# Altium project 模拟均衡器.PrjPCB
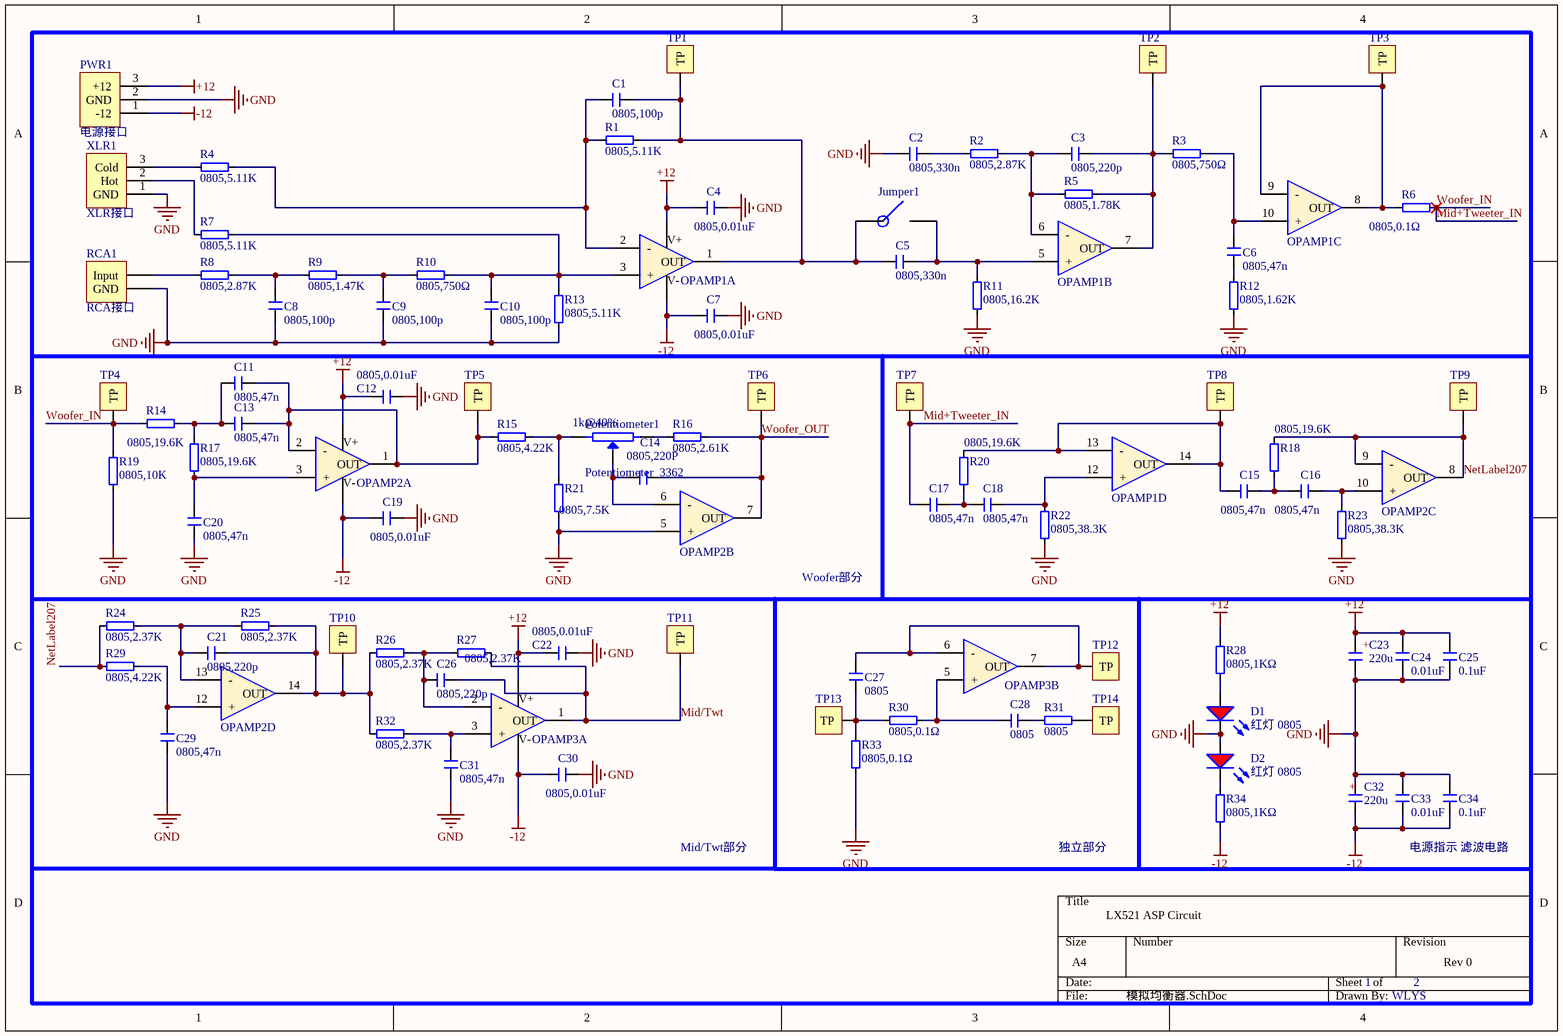
[diagram p0: 模拟均衡器.SchDoc]
2 sheets, 207 parts. Net scope: global (net labels, ports and power ports of the same name join across sheets).
Board file: 模拟均衡器.PcbDoc
Sheets:
  模拟均衡器.SchDoc
  模拟均衡器2.SchDoc

## Sheet 模拟均衡器.SchDoc: LX521 ASP Circuit
size A4; Revision: Rev 0

### Parts
C1  0805,100p  [0805_C]
C2  0805,330n  [0805_C]
C3  0805,220p  [0805_C]
C4  0805,0.01uF  [0805_C]
C5  0805,330n  [0805_C]
C6  0805,47n  [0805_C]
C7  0805,0.01uF  [0805_C]
C8  0805,100p  [0805_C]
C9  0805,100p  [0805_C]
C10  0805,100p  [0805_C]
C11  0805,47n  [0805_C]
C12  0805,0.01uF  [0805_C]
C13  0805,47n  [0805_C]
C14  0805,220P  [0805_C]
C15  0805,47n  [0805_C]
C16  0805,47n  [0805_C]
C17  0805,47n  [0805_C]
C18  0805,47n  [0805_C]
C19  0805,0.01uF  [0805_C]
C20  0805,47n  [0805_C]
C21  0805,220p  [0805_C]
C22  0805,0.01uF  [0805_C]
C23  220u
C24  0.01uF  [0805_C]
C25  0.1uF  [0805_C]
C26  0805,220p  [0805_C]
C27  0805  [0805_C]
C28  0805  [0805_C]
C29  0805,47n  [0805_C]
C30  0805,0.01uF  [0805_C]
C31  0805,47n  [0805_C]
C32  220u
C33  0.01uF  [0805_C]
C34  0.1uF  [0805_C]
D1  红灯 0805  [0805_LED_S3]
D2  红灯 0805  [0805_LED_S3]
Jumper1  Jumper  [0805_J]  (value not drawn)
OPAMP1  4277UA  (value not drawn)  (parts A,B,C,D of 4)
OPAMP2  4277UA  [SOIC-14_150mil]  (value not drawn)  (parts A,B,C,D of 4)
OPAMP3  4277UA  [SOIC-14_150mil]  (value not drawn)  (parts A,B of 4)
Potentiometer1  Potentiometer_3362  [3362P]
PWR1  电源接口
R1  0805,5.11K  [0805_R]
R2  0805,2.87K  [0805_R]
R3  0805,750Ω  [0805_R]
R4  0805,5.11K  [0805_R]
R5  0805,1.78K  [0805_R]
R6  0805,0.1Ω  [0805_R]
R7  0805,5.11K  [0805_R]
R8  0805,2.87K  [0805_R]
R9  0805,1.47K  [0805_R]
R10  0805,750Ω  [0805_R]
R11  0805,16.2K  [0805_R]
R12  0805,1.62K  [0805_R]
R13  0805,5.11K  [0805_R]
R14  0805,19.6K  [0805_R]
R15  0805,4.22K  [0805_R]
R16  0805,2.61K  [0805_R]
R17  0805,19.6K  [0805_R]
R18  0805,19.6K  [0805_R]
R19  0805,10K  [0805_R]
R20  0805,19.6K  [0805_R]
R21  0805,7.5K  [0805_R]
R22  0805,38.3K  [0805_R]
R23  0805,38.3K  [0805_R]
R24  0805,2.37K  [0805_R]
R25  0805,2.37K  [0805_R]
R26  0805,2.37K  [0805_R]
R27  0805,2.37K  [0805_R]
R28  0805,1KΩ  [0805_R]
R29  0805,4.22K  [0805_R]
R30  0805,0.1Ω  [0805_R]
R31  0805  [0805_R]
R32  0805,2.37K  [0805_R]
R33  0805,0.1Ω  [0805_R]
R34  0805,1KΩ  [0805_R]
RCA1  RCA接口  [XH2.54-LI-2P]
TP1  测试点  [TestPoint]  (value not drawn)
TP2  测试点  [TestPoint]  (value not drawn)
TP3  测试点  [TestPoint]  (value not drawn)
TP4  测试点  [TestPoint]  (value not drawn)
TP5  测试点  [TestPoint]  (value not drawn)
TP6  测试点  [TestPoint]  (value not drawn)
TP7  测试点  [TestPoint]  (value not drawn)
TP8  测试点  [TestPoint]  (value not drawn)
TP9  测试点  [TestPoint]  (value not drawn)
TP10  测试点  [TestPoint]  (value not drawn)
TP11  测试点  [TestPoint]  (value not drawn)
TP12  测试点  [TestPoint]  (value not drawn)
TP13  测试点  [TestPoint]  (value not drawn)
TP14  测试点  [TestPoint]  (value not drawn)
XLR1  XLR接口

### Nets
+12: C4.1 C12.1 C22.1 C23.1 C24.2 C25.2 OPAMP1.4(V+) OPAMP2.4(V+) OPAMP3.4(V+) PWR1.3(+12) R28.1
-12: C7.1 C19.1 C30.1 C32.2 C33.1 C34.1 OPAMP1.11(V-) OPAMP2.11(V-) OPAMP3.11(V-) PWR1.1(-12) R34.2
GND: C2.1 C4.2 C7.2 C8.2 C9.2 C10.2 C12.2 C19.2 C20.1 C22.2 C23.2 C24.1 C25.1 C29.1 C30.2 C31.1 C32.1 C33.2 C34.2 D1.K D2.A OPAMP2.5(+) PWR1.2(GND) R11.1 R12.1 R13.1 R19.1 R21.2 R22.1 R23.1 R33.2 RCA1.2(GND) XLR1.1(GND)
Mid+Tweeter_IN: C17.1 R6.2 R14.1 R19.2 TP4.1(TP) TP7.1(TP)  [also labelled Woofer_IN]
Mid/Twt: C26.1 OPAMP3.1(OUT) R27.1 TP11.1(TP)
NetLabel207: OPAMP2.8(OUT) OPAMP2.9(-) R18.2 R24.2 R29.2 TP9.1(TP)
Woofer_OUT: C14.1 OPAMP2.7(OUT) R16.1 TP6.1(TP)
NetC1_1: C1.1 OPAMP1.2(-) R1.1 R4.2
NetC1_2: C1.2 C5.1 Jumper1.1 OPAMP1.1(OUT) R1.2 TP1.1(TP)
NetC2_2: C2.2 R2.1
NetC3_1: C3.1 OPAMP1.6(-) R2.2 R5.1
NetC3_2: C3.2 OPAMP1.7(OUT) R3.1 R5.2 TP2.1(TP)
NetC5_2: C5.2 Jumper1.2 OPAMP1.5(+) R11.2
NetC6_1: C6.1 R12.2
NetC6_2: C6.2 OPAMP1.10(+) R3.2
NetC8_1: C8.1 R8.2 R9.1
NetC9_1: C9.1 R9.2 R10.1
NetC10_1: C10.1 OPAMP1.3(+) R7.2 R10.2 R13.2
NetC11_1: C11.1 C13.1 OPAMP2.1(OUT) OPAMP2.2(-) R15.2 TP5.1(TP)
NetC11_2: C11.2 C13.2 R14.2 R17.2
NetC14_2: C14.2 OPAMP2.6(-) Potentiometer1.2(W)
NetC15_1: C15.1 C16.2 R18.1
NetC15_2: C15.2 OPAMP1.13(-) OPAMP1.14(OUT) R20.2 TP8.1(TP)
NetC16_1: C16.1 OPAMP2.10(+) R23.2
NetC17_2: C17.2 C18.1 R20.1
NetC18_2: C18.2 OPAMP1.12(+) R22.2
NetC20_2: C20.2 OPAMP2.3(+) R17.1
NetC21_1: C21.1 OPAMP2.14(OUT) R25.1 R26.2 R32.2 TP10.1(TP)
NetC21_2: C21.2 OPAMP2.13(-) R24.1 R25.2
NetC26_2: C26.2 OPAMP3.2(-) R26.1 R27.2
NetC27_1: C27.1 R30.2 R33.1 TP13.1(TP)
NetC27_2: C27.2 OPAMP3.6(-) OPAMP3.7(OUT) TP12.1(TP)
NetC28_1: C28.1 R31.2
NetC28_2: C28.2 OPAMP3.5(+) R30.1
NetC29_2: C29.2 OPAMP2.12(+) R29.1
NetC31_2: C31.2 OPAMP3.3(+) R32.1
NetD1_A: D1.A R28.2
NetD2_K: D2.K R34.1
NetOPAMP1_8: OPAMP1.8(OUT) OPAMP1.9(-) R6.1 TP3.1(TP)
NetPotentiometer1_1: Potentiometer1.1 R16.2
NetPotentiometer1_3: Potentiometer1.3 R15.1 R21.1
NetR4_1: R4.1 XLR1.3(Cold)
NetR7_1: R7.1 XLR1.2(Hot)
NetR8_1: R8.1 RCA1.1(Input)
NetR31_1: R31.1 TP14.1(TP)

### Notes on the sheet
- (near Potentiometer1) 1k@40%
- Woofer部分
- Mid/Twt部分
- 独立部分
- 电源指示 滤波电路
- LX521 ASP Circuit
- 1
- 2
- Rev 0
- WLYS
- (in symbol C直插电解) +

### Library data of the parts
C1-C3 C5 C6 C8-C11 C13-C18 C20 C21 C24-C26 C29 C31 C33 C34 = C0805
C4 C7 C12 C19 C22 C27 C28 C30 = C0805: 0.01uF
C23 C32 = C直插电解
D1 D2 = 0805 红灯: 发光二极管; ComponentLink1Description: 供应商链接; ComponentLink1URL: http://www.szlcsc.com/product/details_2668.html; Package: 0805; Supplier: LC; SuppliersPartNumber: C2295
OPAMP1-OPAMP3 = OPA4277UA
R1-R34 = R0805

## Sheet 模拟均衡器2.SchDoc
size A4
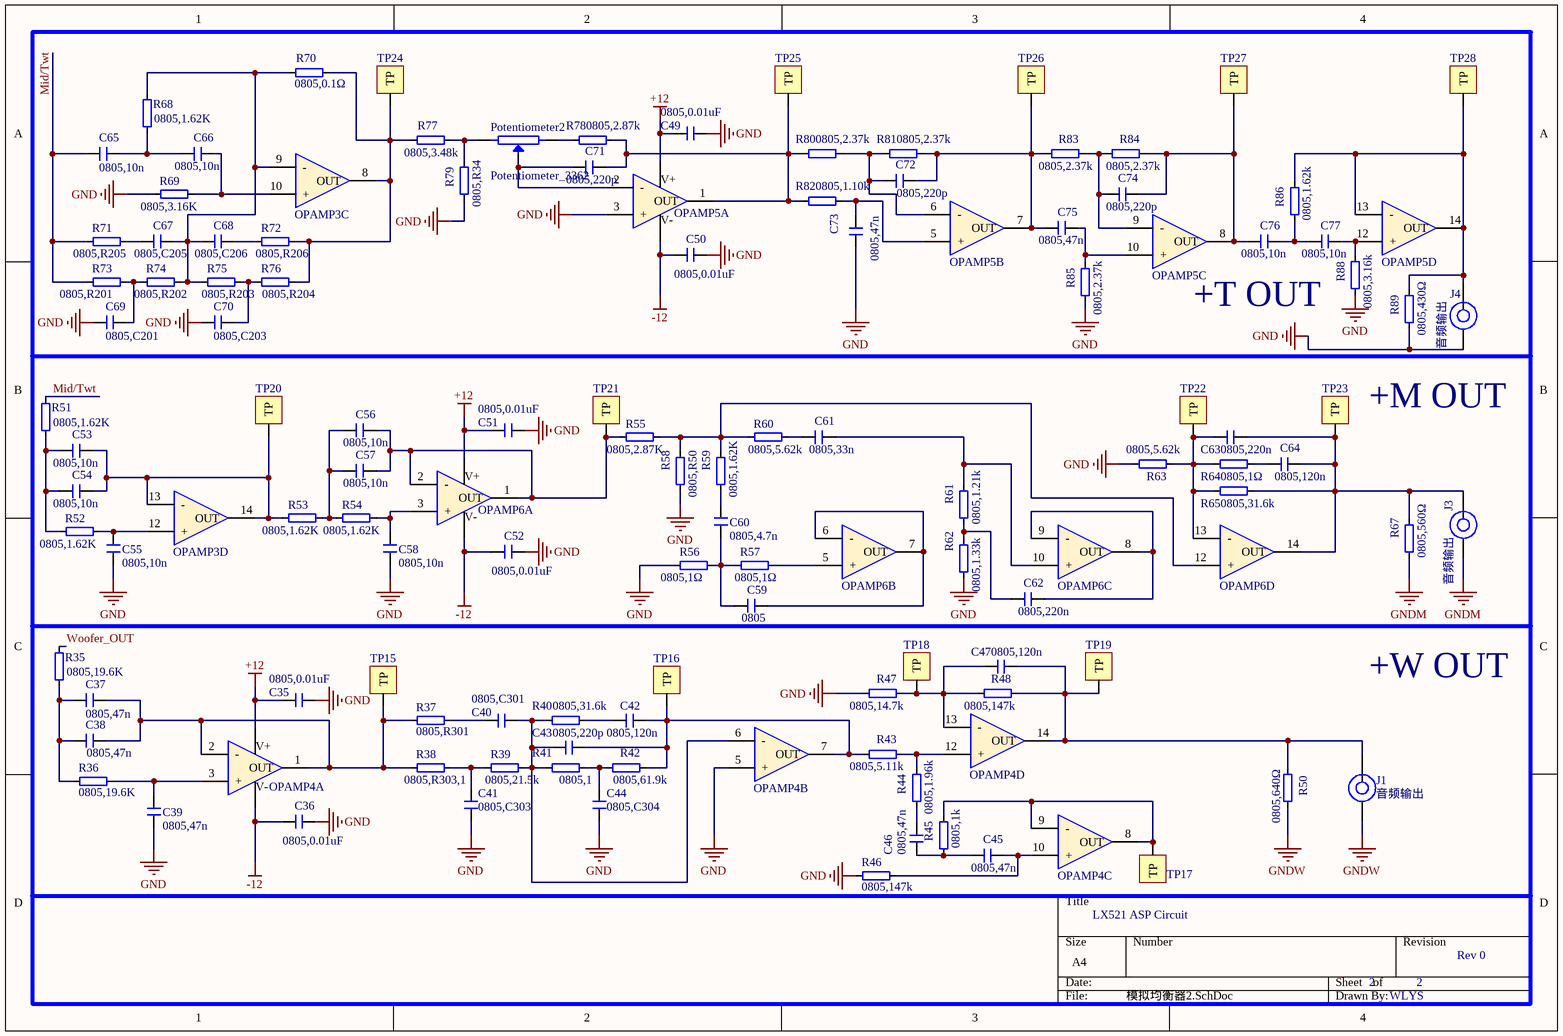
[diagram p1: 模拟均衡器2.SchDoc]

### Parts
C35  0805,0.01uF  [0805_C]
C36  0805,0.01uF  [0805_C]
C37  0805,47n  [0805_C]
C38  0805,47n  [0805_C]
C39  0805,47n  [0805_C]
C40  0805,C301  [0805_C]
C41  0805,C303  [0805_C]
C42  0805,120n  [0805_C]
C43  0805,220p  [0805_C]
C44  0805,C304  [0805_C]
C45  0805,47n  [0805_C]
C46  0805,47n  [0805_C]
C47  0805,120n  [0805_C]
C49  0805,0.01uF  [0805_C]
C50  0805,0.01uF  [0805_C]
C51  0805,0.01uF  [0805_C]
C52  0805,0.01uF  [0805_C]
C53  0805,10n  [0805_C]
C54  0805,10n  [0805_C]
C55  0805,10n  [0805_C]
C56  0805,10n  [0805_C]
C57  0805,10n  [0805_C]
C58  0805,10n  [0805_C]
C59  0805  [0805_C]
C60  0805,4.7n  [0805_C]
C61  0805,33n  [0805_C]
C62  0805,220n  [0805_C]
C63  0805,220n  [0805_C]
C64  0805,120n  [0805_C]
C65  0805,10n  [0805_C]
C66  0805,10n  [0805_C]
C67  0805,C205  [0805_C]
C68  0805,C206  [0805_C]
C69  0805,C201  [0805_C]
C70  0805,C203  [0805_C]
C71  0805,220p  [0805_C]
C72  0805,220p  [0805_C]
C73  0805,47n  [0805_C]
C74  0805,220p  [0805_C]
C75  0805,47n  [0805_C]
C76  0805,10n  [0805_C]
C77  0805,10n  [0805_C]
J1  音频输出
J3  音频输出
J4  音频输出
OPAMP3  4277UA  [SOIC-14_150mil]  (value not drawn)  (parts C,D of 4)
OPAMP4  4277UA  [SOIC-14_150mil]  (value not drawn)  (parts A,B,C,D of 4)
OPAMP5  4277UA  [SOIC-14_150mil]  (value not drawn)  (parts A,B,C,D of 4)
OPAMP6  4277UA  [SOIC-14_150mil]  (value not drawn)  (parts A,B,C,D of 4)
Potentiometer2  Potentiometer_3362  [3362P]
R35  0805,19.6K  [0805_R]
R36  0805,19.6K  [0805_R]
R37  0805,R301  [0805_R]
R38  0805,R303,1  [0805_R]
R39  0805,21.5k  [0805_R]
R40  0805,31.6k  [0805_R]
R41  0805,1  [0805_R]
R42  0805,61.9k  [0805_R]
R43  0805,5.11k  [0805_R]
R44  0805,1.96k  [0805_R]
R45  0805,1k  [0805_R]
R46  0805,147k  [0805_R]
R47  0805,14.7k  [0805_R]
R48  0805,147k  [0805_R]
R50  0805,640Ω  [0805_R]
R51  0805,1.62K  [0805_R]
R52  0805,1.62K  [0805_R]
R53  0805,1.62K  [0805_R]
R54  0805,1.62K  [0805_R]
R55  0805,2.87K  [0805_R]
R56  0805,1Ω  [0805_R]
R57  0805,1Ω  [0805_R]
R58  0805,R50  [0805_R]
R59  0805,1.62K  [0805_R]
R60  0805,5.62k  [0805_R]
R61  0805,1.21k  [0805_R]
R62  0805,1.33k  [0805_R]
R63  0805,5.62k  [0805_R]
R64  0805,1Ω  [0805_R]
R65  0805,31.6k  [0805_R]
R67  0805,560Ω  [0805_R]
R68  0805,1.62K  [0805_R]
R69  0805,3.16K  [0805_R]
R70  0805,0.1Ω  [0805_R]
R71  0805,R205  [0805_R]
R72  0805,R206  [0805_R]
R73  0805,R201  [0805_R]
R74  0805,R202  [0805_R]
R75  0805,R203  [0805_R]
R76  0805,R204  [0805_R]
R77  0805,3.48k  [0805_R]
R78  0805,2.87k  [0805_R]
R79  0805,R34  [0805_R]
R80  0805,2.37k  [0805_R]
R81  0805,2.37k  [0805_R]
R82  0805,1.10k  [0805_R]
R83  0805,2.37k  [0805_R]
R84  0805,2.37k  [0805_R]
R85  0805,2.37k  [0805_R]
R86  0805,1.62k  [0805_R]
R88  0805,3.16k  [0805_R]
R89  0805,430Ω  [0805_R]
TP15  测试点  [TestPoint]  (value not drawn)
TP16  测试点  [TestPoint]  (value not drawn)
TP17  测试点  [TestPoint]  (value not drawn)
TP18  测试点  [TestPoint]  (value not drawn)
TP19  测试点  [TestPoint]  (value not drawn)
TP20  测试点  [TestPoint]  (value not drawn)
TP21  测试点  [TestPoint]  (value not drawn)
TP22  测试点  [TestPoint]  (value not drawn)
TP23  测试点  [TestPoint]  (value not drawn)
TP24  测试点  [TestPoint]  (value not drawn)
TP25  测试点  [TestPoint]  (value not drawn)
TP26  测试点  [TestPoint]  (value not drawn)
TP27  测试点  [TestPoint]  (value not drawn)
TP28  测试点  [TestPoint]  (value not drawn)

### Nets
+12: C35.1 C49.1 C51.1 OPAMP4.4(V+) OPAMP5.4(V+) OPAMP6.4(V+)
-12: C36.1 C50.1 C52.1 OPAMP4.11(V-) OPAMP5.11(V-) OPAMP6.11(V-)
GND: C35.2 C36.2 C39.2 C41.1 C44.1 C49.2 C50.2 C51.2 C52.2 C55.2 C58.2 C69.2 C70.1 C73.2 J4.2(GND) OPAMP4.5(+) OPAMP5.3(+) R46.2 R47.1 R56.1 R58.1 R62.1 R63.1 R69.1 R79.1 R85.1 R88.2 R89.2
GNDM: J3.2(GND) R67.1
GNDW: J1.2(GND) R50.2
Mid/Twt: C65.1 R51.1 R71.1 R73.1
Woofer_OUT: R35.1
NetC37_1: C37.1 C38.1 OPAMP4.1(OUT) OPAMP4.2(-) R37.1 R38.1 TP15.1(TP)
NetC37_2: C37.2 C38.2 R35.2 R36.1
NetC39_1: C39.1 OPAMP4.3(+) R36.2
NetC40_1: C40.1 R37.2
NetC40_2: C40.2 C43.1 OPAMP4.6(-) R39.2 R40.1 R41.1
NetC41_2: C41.2 R38.2 R39.1
NetC42_1: C42.1 R40.2
NetC42_2: C42.2 C43.2 OPAMP4.7(OUT) R42.2 R43.1 TP16.1(TP)
NetC44_2: C44.2 R41.2 R42.1
NetC45_1: C45.1 C46.2 R45.1
NetC45_2: C45.2 OPAMP4.10(+) R46.1
NetC46_1: C46.1 R44.1
NetC47_1: C47.1 OPAMP4.13(-) R47.2 R48.1 TP18.1(TP)
NetC47_2: C47.2 J1.1(MIC) OPAMP4.14(OUT) R48.2 R50.1 TP19.1(TP)
NetC53_1: C53.1 C54.1 OPAMP3.13(-) OPAMP3.14(OUT) R53.1 TP20.1(TP)
NetC53_2: C53.2 C54.2 R51.2 R52.1
NetC55_1: C55.1 OPAMP3.12(+) R52.2
NetC56_1: C56.1 C57.1 R53.2 R54.1
NetC56_2: C56.2 C57.2 OPAMP6.1(OUT) OPAMP6.2(-) R55.1 TP21.1(TP)
NetC58_1: C58.1 OPAMP6.3(+) R54.2
NetC59_1: C59.1 C60.1 R56.2 R57.1
NetC59_2: C59.2 OPAMP6.6(-) OPAMP6.7(OUT)
NetC60_2: C60.2 R59.1
NetC61_1: C61.1 R60.2
NetC61_2: C61.2 OPAMP6.10(+) R61.2
NetC62_1: C62.1 R61.1 R62.2
NetC62_2: C62.2 OPAMP6.8(OUT) OPAMP6.9(-)
NetC63_1: C63.1 OPAMP6.13(-) R63.2 R64.1 R65.1 TP22.1(TP)
NetC63_2: C63.2 C64.2 J3.1(MIC) OPAMP6.14(OUT) R65.2 R67.2 TP23.1(TP)
NetC64_1: C64.1 R64.2
NetC65_2: C65.2 C66.2 R68.2
NetC66_1: C66.1 OPAMP3.10(+) R69.2
NetC67_1: C67.1 C68.2 OPAMP3.9(-) R68.1 R70.1 R74.2 R75.1
NetC67_2: C67.2 R71.2
NetC68_1: C68.1 R72.1
NetC69_1: C69.1 R73.2 R74.1
NetC70_2: C70.2 R75.2 R76.1
NetC71_1: C71.1 OPAMP5.1(OUT) R78.2 R80.1 R82.1 TP25.1(TP)
NetC71_2: C71.2 OPAMP5.2(-) Potentiometer2.2(W)
NetC72_1: C72.1 OPAMP5.6(-) R80.2 R81.1
NetC72_2: C72.2 C75.1 OPAMP5.7(OUT) R81.2 R83.1 TP26.1(TP)
NetC73_1: C73.1 OPAMP5.5(+) R82.2
NetC74_1: C74.1 OPAMP5.9(-) R83.2 R84.1
NetC74_2: C74.2 C76.1 OPAMP5.8(OUT) R84.2 TP27.1(TP)
NetC75_2: C75.2 OPAMP5.10(+) R85.2
NetC76_2: C76.2 C77.1 R86.1
NetC77_2: C77.2 OPAMP5.12(+) R88.1
NetJ4_1: J4.1(MIC) OPAMP5.13(-) OPAMP5.14(OUT) R86.2 R89.1 TP28.1(TP)
NetOPAMP3_8: OPAMP3.8(OUT) R70.2 R72.2 R76.2 R77.1 TP24.1(TP)
NetOPAMP4_8: OPAMP4.8(OUT) OPAMP4.9(-) R45.2 TP17.1(TP)
NetOPAMP4_12: OPAMP4.12(+) R43.2 R44.2
NetOPAMP6_5: OPAMP6.5(+) R57.2
NetOPAMP6_12: OPAMP6.12(+) R55.2 R58.2 R59.2 R60.1
NetPotentiometer2_1: Potentiometer2.1 R78.1
NetPotentiometer2_3: Potentiometer2.3 R77.2 R79.2

### Notes on the sheet
- +T OUT
- +M OUT
- +W OUT
- LX521 ASP Circuit
- 2
- Rev 0
- WLYS

### Library data of the parts
C35 C36 C40-C44 C47 C49-C52 = C0805: 0.01uF
C37-C39 C45 C46 C53-C77 = C0805
OPAMP3-OPAMP6 = OPA4277UA
R35-R48 R50-R65 R67-R86 R88 R89 = R0805

## Nets that join several sheets
+12: 模拟均衡器 (11 pins), 模拟均衡器2 (6 pins)
-12: 模拟均衡器 (11 pins), 模拟均衡器2 (6 pins)
GND: 模拟均衡器 (33 pins), 模拟均衡器2 (28 pins)
Mid/Twt: 模拟均衡器 (C26.1 OPAMP3.1 R27.1 TP11.1), 模拟均衡器2 (C65.1 R51.1 R71.1 R73.1)
Woofer_OUT: 模拟均衡器 (C14.1 OPAMP2.7 R16.1 TP6.1), 模拟均衡器2 (R35.1)